# Altium project Sensor_Glove-X01.PrjPcb (part 2 of 4)

## Sheet Sensor_Glove_Pheripherals-X01.SchDoc: PHERIPHERALS
size Letter; Author: C. DEMOLDER; CompanyName: GTBID; DrawnBy: C. DEMOLDER; Engineer: C. DEMOLDER; Organization: GEORGIA TECH; Address1: NORTH AVE NW; Address2: ATLANTA, GA, 30332; DocumentNumber: P001; Revision: X01; SheetNumber: 2; SheetTotal: 4
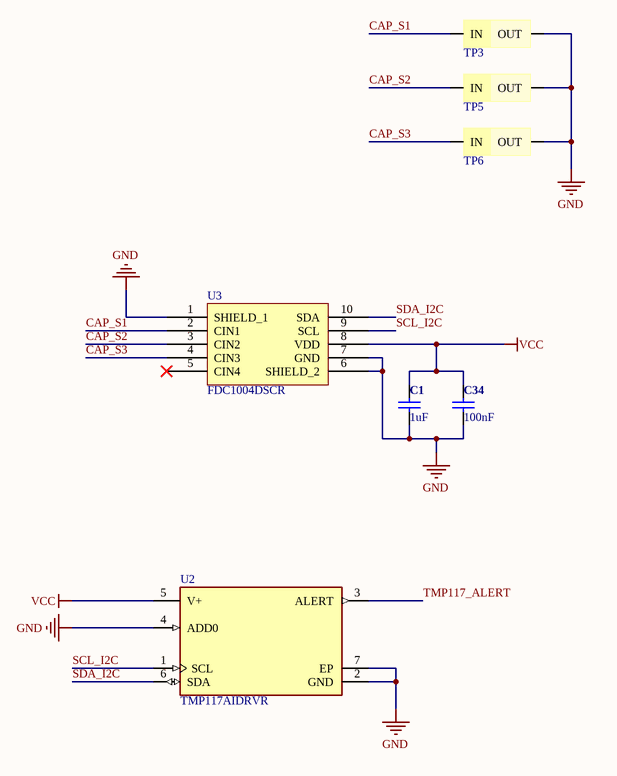
[diagram p1: Sensor_Glove_Pheripherals-X01.SchDoc]

### Parts
C1  1uF  [C0402]
C34  100nF  [C0402]
TP3  JUMPER  [JUMPER]  (value not drawn)
TP5  JUMPER  [JUMPER]  (value not drawn)
TP6  JUMPER  [JUMPER]  (value not drawn)
U2  TMP117AIDRVR  [TMP117AIDRVR]
U3  Manufacturer Part Number: FDC1004DSCR  [WSON-10 3X3MM]  (hidden comment: 4 CHANNEL CDC)

### Nets
GND: C1.2 C34.2 TP3.2(OUT) TP5.2(OUT) TP6.2(OUT) U2.2(GND) U2.4(ADD0) U2.7(EP) U3.1(SHIELD_1) U3.6(SHIELD_2) U3.7(GND)
VCC: C1.1 C34.1 U2.5(V+) U3.8(VDD)
CAP_S1: TP3.1(IN) U3.2(CIN1)
CAP_S2: TP5.1(IN) U3.3(CIN2)
CAP_S3: TP6.1(IN) U3.4(CIN3)
SCL_I2C: U2.1(SCL) U3.9(SCL)
SDA_I2C: U2.6(SDA) U3.10(SDA)
TMP117_ALERT: U2.3(ALERT)

Not connected (* = marked no-connect by the designer): U3 5(CIN4)*

### Notes on the sheet
- Title
- Size:
- Date:
- Letter
- Number:
- Time:
- Revision:
- Sheet
- of
- File:

### Library data of the parts
C1 = C-0402(1005): Ceramic Capacitor, Multilayer, Ceramic, 6.3V, 20% +Tol, 20% -Tol, X5R, 15% TC, 1uF, Surface Mount, 0402; Manufacturer: Yageo; Manufacturer Part Number: CC0402MRX5R5BB105; Dissipation Factor: 10%; ComponentLink1URL: https://datasheet.ciiva.com/169/product-169683.pdf; ComponentLink1Description: https://datasheet.ciiva.com/169/product-169683.pdf; Supplier 1: Digi-Key; Supplier Part Number 1: 311-1441-1-ND; RoHS: Yes; Category: Ceramic Capacitors; Stock 1: 4097; Pricing 1: 1=0.12000, 10=0.08500, 50=0.04860, 100=0.04020, 500=0.02818, 1000=0.02333, 2500=0.02172, 5000=0.01987 (USD); Mount: Surface Mount; Case/Package: 0402; Number of Pins: 2; Case Code (Imperial): 0402; Case Code (Metric): 1005; Min Operating Temperature: -55°C; Max Operating Temperature: 85°C; Capacitance: 1uF; Tolerance: 20%; Voltage Rating: 6.3V; Voltage Rating (DC): 6.3V; Packaging: Tape and Reel; Package Quantity: 1; Dielectric: X5R; Termination: SMD/SMT; Resistor Type: Ceramic; Length: 1mm; Height: 0.5mm; Width: 0.5mm; Thickness: 0.022inch; Depth: 0.5mm; Lead Free: Lead Free; Halogen Free: Halogen Free; ComponentLink2URL: https://datasheet.ciiva.com:443/pdfs/VipMasterIC/IC/YAGO/YAGO-S-A0006851646/YAGO-S-A0006851646-1.pdf?src-supplier=IHS+Markit; ComponentLink2Description: https://datasheet.ciiva.com:443/pdfs/VipMasterIC/IC/YAGO/YAGO-S-A0006851646/YAGO-S-A0006851646-1.pdf?src-supplier=IHS+Markit; ComponentLink3URL: https://datasheet.ciiva.com/176/mlccorderingcode-176806.pdf?src-supplier=Digi-Key; ComponentLink3Description: https://datasheet.ciiva.com/176/mlccorderingcode-176806.pdf?src-supplier=Digi-Key; ComponentLink4URL: https://datasheet.ciiva.com/176/mlccorderingcode-176807.pdf?src-supplier=Digi-Key; ComponentLink4Description: https://datasheet.ciiva.com/176/mlccorderingcode-176807.pdf?src-supplier=Digi-Key; ComponentLink5URL: https://datasheet.ciiva.com/176/mlccorderingcode-176808.pdf?src-supplier=Digi-Key; ComponentLink5Description: https://datasheet.ciiva.com/176/mlccorderingcode-176808.pdf?src-supplier=Digi-Key
C34 = C-0402(1005): Ceramic Capacitor, Multilayer, Ceramic, 25V, 10% +Tol, 10% -Tol, X5R, 15% TC, 0.1uF, Surface Mount, 0402; Manufacturer: Taiyo Yuden; Manufacturer Part Number: TMK105BJ104KV-F; ComponentLink1URL: https://datasheet.ciiva.com/169/product-169683.pdf; ComponentLink1Description: https://datasheet.ciiva.com/169/product-169683.pdf; Supplier 1: Digi-Key; Supplier Part Number 1: 587-1456-1-ND; RoHS: Yes; Category: Ceramic Capacitors; Stock 1: 21960903; Pricing 1: 1=0.10000, 10=0.04400, 50=0.02400, 100=0.01960, 500=0.01398, 1000=0.01098, 2500=0.00998, 5000=0.00918 (USD); Mount: Surface Mount; Case/Package: 0402; Number of Pins: 2; Weight: 2.3E-05oz; Case Code (Imperial): 0402; Case Code (Metric): 1005; Min Operating Temperature: -55°C; Max Operating Temperature: 85°C; Capacitance: 100nF; Tolerance: 10%; Packaging: Tape and Reel; Dielectric: X5R; Voltage Rating (DC): 25V; Voltage Rating: 25V; Package Quantity: 1; Termination: SMD/SMT; Resistor Type: Ceramic; Voltage: 25V; Length: 1mm; Height: 0.5mm; Width: 0.5mm; Depth: 0.5mm; Thickness: 0.022inch; REACH SVHC: No SVHC; Lead Free: Lead Free; Halogen Free: Halogen Free; ComponentLink2URL: https://datasheet.ciiva.com:443/pdfs/VipMasterIC/IC/TAIY/TAIY-S-A0009103435/TAIY-S-A0009103038-1.pdf?src-supplier=IHS+Markit; ComponentLink2Description: https://datasheet.ciiva.com:443/pdfs/VipMasterIC/IC/TAIY/TAIY-S-A0009103435/TAIY-S-A0009103038-1.pdf?src-supplier=IHS+Markit; ComponentLink3URL: https://datasheet.ciiva.com/30051/25tmk105bj104kv-f-30051094.pdf?src-supplier=Onlinecomponents.com; ComponentLink3Description: https://datasheet.ciiva.com/30051/25tmk105bj104kv-f-30051094.pdf?src-supplier=Onlinecomponents.com; ComponentLink4URL: https://datasheet.ciiva.com/15922/28tmk105bj104kv-f-15922315.pdf?src-supplier=Onlinecomponents.com; ComponentLink4Description: https://datasheet.ciiva.com/15922/28tmk105bj104kv-f-15922315.pdf?src-supplier=Onlinecomponents.com; ComponentLink5URL: https://datasheet.ciiva.com/131/tmk105bj104kv-f-ss-131420.pdf?src-supplier=Digi-Key; ComponentLink5Description: https://datasheet.ciiva.com/131/tmk105bj104kv-f-ss-131420.pdf?src-supplier=Digi-Key; ComponentLink6URL: https://datasheet.ciiva.com/22768/1693457-22768649.pdf?src-supplier=Farnell; ComponentLink6Description: https://datasheet.ciiva.com/22768/1693457-22768649.pdf?src-supplier=Farnell
TP3 TP5 TP6 = JUMPER: SHUNT LP W/HANDLE 2 POS 30AU; Manufacturer: TE Connectivity; Manufacturer Part Number: 8815452; Number of Contacts: 2; Contact Current Rating: 3A; Contact Resistance: 15mR; Gender: Female; Pitch: 2.54mm; Approvals: UL,CSA; Supplier 1: Digi-Key; Supplier Part Number 1: A26242-ND; RoHS: Yes; Category: Headers and Wire Housings; Stock 1: 2099; Pricing 1: 1=0.280000, 10=0.262000, 25=0.223600, 50=0.195600, 100=0.181700, 250=0.160760, 500=0.153760, 1000=0.125800, 2500=0.115320 (USD); Contact Plating: Gold; Housing Color: Black; Housing Material: Thermoplastic; Contact Material: Bronze; Color: Black; Min Operating Temperature: -65°C; Max Operating Temperature: 105°C; Number of Rows: 1; Package Quantity: 14000; Packaging: Bag; Orientation: Straight; Number of Positions: 2; Contact Gender: Female; Current Rating: 3A; Termination: Solder; Length: 5.08mm; Height: 10.9mm; Depth: 10.9mm; Width: 2.5mm; Radiation Hardening: No; Flammability Rating: UL94 V-0; REACH SVHC: No SVHC; ComponentLink1URL: https://datasheet.ciiva.com/1455/92946-1455888.pdf?src-supplier=Newark; ComponentLink1Description: https://datasheet.ciiva.com/1455/92946-1455888.pdf?src-supplier=Newark; ComponentLink2URL: https://datasheet.ciiva.com/19459/841467-19459897.pdf?src-supplier=Jameco; ComponentLink2Description: https://datasheet.ciiva.com/19459/841467-19459897.pdf?src-supplier=Jameco; ComponentLink3URL: https://datasheet.ciiva.com/15174/getdatasheetpartid-155768-15174939.pdf?src-supplier=Verical; ComponentLink3Description: https://datasheet.ciiva.com/15174/getdatasheetpartid-155768-15174939.pdf?src-supplier=Verical; ComponentLink4URL: https://datasheet.ciiva.com/11754/0900766b80da19e8-11754990.pdf?src-supplier=RSComponents; ComponentLink4Description: https://datasheet.ciiva.com/11754/0900766b80da19e8-11754990.pdf?src-supplier=RSComponents; ComponentLink5URL: https://datasheet.ciiva.com/30154/eng-cs-1307819-section-6-7and8-0808-30154293.pdf?src-supplier=Onlinecomponents.com; ComponentLink5Description: https://datasheet.ciiva.com/30154/eng-cs-1307819-section-6-7and8-0808-30154293.pdf?src-supplier=Onlinecomponents.com; ComponentLink6URL: https://datasheet.ciiva.com/767/eng-cd-881545-k3-767850.pdf?src-supplier=Digi-Key; ComponentLink6Description: https://datasheet.ciiva.com/767/eng-cd-881545-k3-767850.pdf?src-supplier=Digi-Key; ComponentLink7URL: https://datasheet.ciiva.com/3120/eng-cs-1307819-section-6-7and8-0808-3120202.pdf?src-supplier=Avnet; ComponentLink7Description: https://datasheet.ciiva.com/3120/eng-cs-1307819-section-6-7and8-0808-3120202.pdf?src-supplier=Avnet
U2 = bceab6869a9cb85cf5675529ee35ce4: TEMPERATURE SENSOR; Manufacturer: Texas Instruments; Operating Supply Current: 3.5-16uA; Standoff Height: 0mm; Min Supply Voltage: 1.8V; Resolution: 16bits; Interface: I2C,2-Wire,SMBus; Max Junction Temp: +150°C; Max Supply Voltage: 5.5V; Output Type: I2C; Octopart: https://octopart.com/tmp117aidrvr-texas+instruments-95511044; Lead Free: Yes; ComponentLink2Description: Datasheet; Temperature Range High: +150°C; Manufacturer Part Number: TMP117AIDRVR; Ambient Temperature Range High: +150°C; Ambient Temperature Range Low: -55°C; Height: 0.8mm; ComponentLink2URL: http://www.ti.com/lit/ds/symlink/tmp117.pdf; Automotive: No; Device Class L1: Sensors; RoHS: TRUE; Package: DRV0006A; Device Class L3: unset; Temperature: -55°C to +150°C; Temperature Range Low: -55°C; Ipc Land Pattern Name: DFN200X200X80-6; Device Class L2: Temperature and Humidity Sensors; Category: IC; Digikey Description: TEMPERATURE SENSOR; Supplier 1: Digi-Key; Supplier Part Number 1: 296-51834-1-ND; Stock 1: 3558; Pricing 1: 1=8.02000, 5=7.07600, 10=6.25000, 25=5.07040, 50=4.48100, 100=4.36300, 500=3.65552, 1000=3.41968 (USD); Mount: Surface Mount; Min Operating Temperature: -55°C; Max Operating Temperature: 150°C; Packaging: Cut Tape; ComponentLink1URL: https://www.ti.com:443/lit/ds/symlink/tmp117.pdf?src-supplier=IHS+Markit; ComponentLink1Description: https://www.ti.com:443/lit/ds/symlink/tmp117.pdf?src-supplier=IHS+Markit; ComponentLink3URL: http://www.ti.com/lit/gpn/tmp117?src-supplier=Digi-Key; ComponentLink3Description: http://www.ti.com/lit/gpn/tmp117?src-supplier=Digi-Key
U3 = FDC1004: Analog Circuit, 1 Func, 4 Channel, PDSO10; Manufacturer: Texas Instruments; Interface: I2C; Number of Inputs: 4; Supplier 1: Digi-Key; RoHS: Yes; Category: Integrated Circuits (ICs); Stock 1: 1027; Pricing 1: 1=7.13000, 5=6.25000, 10=5.62500, 25=5.00000, 50=4.62500, 100=4.00000, 500=3.75000 (USD); Number of Pins: 10; Min Operating Temperature: -40°C; Max Operating Temperature: 125°C; Packaging: Tape and Reel; Radiation Hardening: No; Lead Free: Lead Free; ComponentLink1URL: https://www.ti.com:443/lit/ds/symlink/fdc1004.pdf?src-supplier=IHS+Markit; ComponentLink1Description: https://www.ti.com:443/lit/ds/symlink/fdc1004.pdf?src-supplier=IHS+Markit; ComponentLink2URL: https://datasheet.ciiva.com/48512/fdc1004-48512055.pdf?src-supplier=Avnet; ComponentLink2Description: https://datasheet.ciiva.com/48512/fdc1004-48512055.pdf?src-supplier=Avnet; Supplier Part Number 1: 296-46090-1-ND

## Sheet Sensor_Glove_Power-X01.SchDoc: SENSOR GLOVE POWER
size Letter; Author: C. DEMOLDER; Engineer: C. DEMOLDER; Organization: GEORGIA TECH; Address1: NORTH AVE NW; Address2: ATLANTA, GA, 30332; DocumentNumber: P001; Revision: X01; SheetNumber: 3; SheetTotal: 4
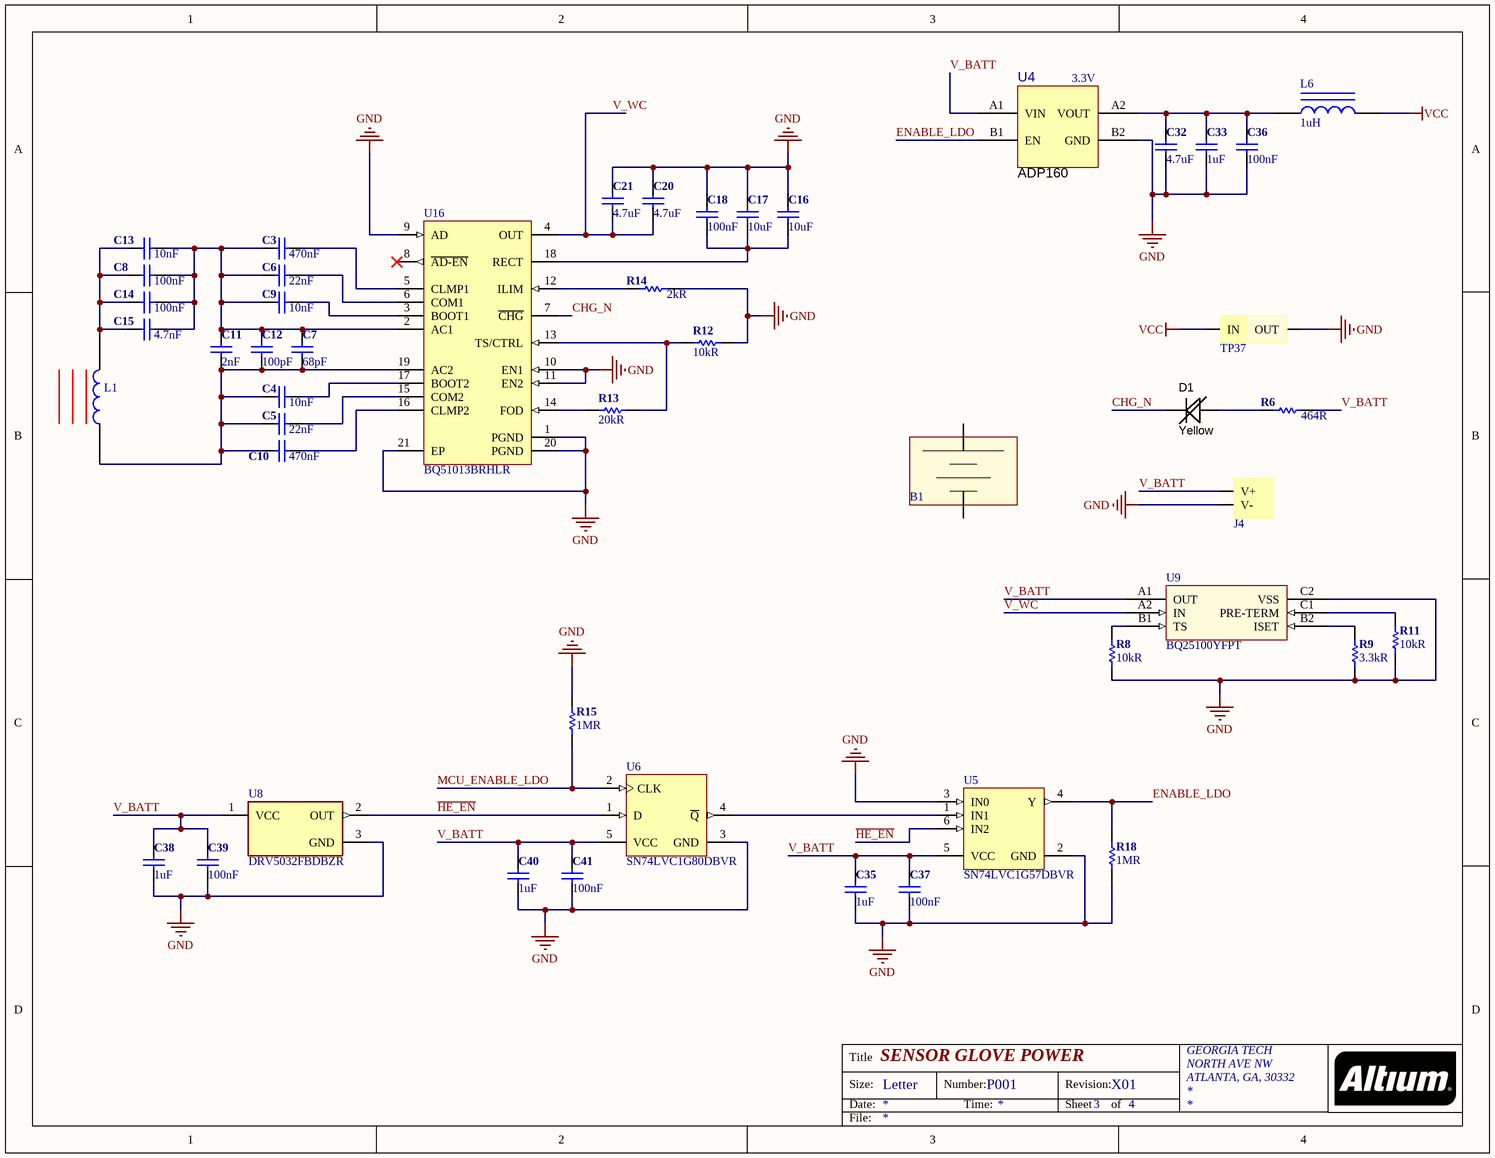
[diagram p2: Sensor_Glove_Power-X01.SchDoc]

### Parts
B1  40 mAh BATTERY  [BATTERY]  (value not drawn)
C3  470nF  [C0402]
C4  10nF  [C0402]
C5  22nF  [C0402]
C6  22nF  [C0402]
C7  68pF  [C0402]
C8  100nF  [C0402]
C9  10nF  [C0402]
C10  470nF  [C0402]
C11  2nF  [C0402]
C12  100pF  [C0402]
C13  10nF  [C0402]
C14  100nF  [C0402]
C15  4.7nF  [C0402]
C16  10uF  [C0603]
C17  10uF  [C0603]
C18  100nF  [C0603]
C20  4.7uF  [C0402]
C21  4.7uF  [C0402]
C32  4.7uF  [C0402]
C33  1uF  [C0402]
C35  1uF  [C0402]
C36  100nF  [C0402]
C37  100nF  [C0402]
C38  1uF  [C0402]
C39  100nF  [C0402]
C40  1uF  [C0402]
C41  100nF  [C0402]
D1  Yellow  [LED_0402]
J4  JUMPER WITH 40 mAh BATTERY  [JUMPER_BATTERY]  (value not drawn)
L1  WIRELESS CHARGING COIL, RECEIVER  [760308101219]  (value not drawn)
L6  1uH  [L0402]
R6  464R  [R0402]
R8  10kR  [R0402]
R9  3.3kR  [R0402]
R11  10kR  [R0402]
R12  10kR  [R0402]
R13  20kR  [R0402]
R14  2kR  [R0402]
R15  1MR  [R0402]
R18  1MR  [R0402]
TP37  JUMPER  [JUMPER]  (value not drawn)
U4  ADP160  Output Voltage: 3.3V  [ADP160]
U5  SN74LVC1G57DBVR  [DBV0006A_M]
U6  SN74LVC1G80DBVR  [DBV0005A_N]
U8  DRV5032FBDBZR  [FP-DBZ0003A-MFG]
U9  BQ25100YFPT  [YZP0006]
U16  BQ51013BRHLR  [BQ51013BRHLR]

### Nets
GND: C16.2 C17.2 C18.2 C20.1 C21.1 C32.2 C33.2 C35.2 C36.1 C37.1 C38.2 C39.1 C40.2 C41.1 J4.2(V-) R8.1 R9.1 R11.1 R12.2 R14.2 R15.1 R18.2 TP37.2(OUT) U4.B2(GND) U5.2(GND) U5.3(IN0) U6.3(GND) U8.3(GND) U9.C2(VSS) U16.1(PGND) U16.9(AD) U16.10(EN1) U16.11(EN2) U16.20(PGND) U16.21(EP)
VCC: L6.2 TP37.1(IN)
~{HE_EN}: U5.6(IN2) U6.1(D) U8.2(OUT)
CHG_N: D1.K U16.7(~{CHG})
ENABLE_LDO: R18.1 U4.B1(EN) U5.4(Y)
MCU_ENABLE_LDO: R15.2 U6.2(CLK)
V_BATT: C35.1 C37.2 C38.1 C39.2 C40.1 C41.2 J4.1(V+) R6.2 U4.A1(VIN) U5.5(VCC) U6.5(VCC) U8.1(VCC) U9.A1(OUT)
V_WC: C20.2 C21.2 U9.A2(IN) U16.4(OUT)
NetC3_1: C3.1 C6.1 C7.1 C8.2 C9.1 C11.1 C12.1 C13.2 C14.2 C15.2 U16.2(AC1)
NetC3_2: C3.2 U16.5(CLMP1)
NetC4_1: C4.1 C5.1 C7.2 C10.1 C11.2 C12.2 L1.1 U16.19(AC2)
NetC4_2: C4.2 U16.17(BOOT2)
NetC5_2: C5.2 U16.15(COM2)
NetC6_2: C6.2 U16.6(COM1)
NetC8_1: C8.1 C13.1 C14.1 C15.1 L1.2
NetC9_2: C9.2 U16.3(BOOT1)
NetC10_2: C10.2 U16.16(CLMP2)
NetC16_1: C16.1 C17.1 C18.1 U16.18(RECT)
NetC32_1: C32.1 C33.1 C36.2 L6.1 U4.A2(VOUT)
NetD1_A: D1.A R6.1
NetR8_2: R8.2 U9.B1(TS)
NetR9_2: R9.2 U9.B2(ISET)
NetR11_2: R11.2 U9.C1(PRE-TERM)
NetR12_1: R12.1 R13.2 U16.13(TS/CTRL)
NetR13_1: R13.1 U16.14(FOD)
NetR14_1: R14.1 U16.12(ILIM)
NetU5_1: U5.1(IN1) U6.4(~{Q})

Not connected (* = marked no-connect by the designer): U16 8(~{AD-EN})*

### Notes on the sheet
- Title
- Size:
- Date:
- Letter
- Number:
- Time:
- Revision:
- Sheet
- of
- File: